# EAGLE design board (EAGLE 8.5.1)
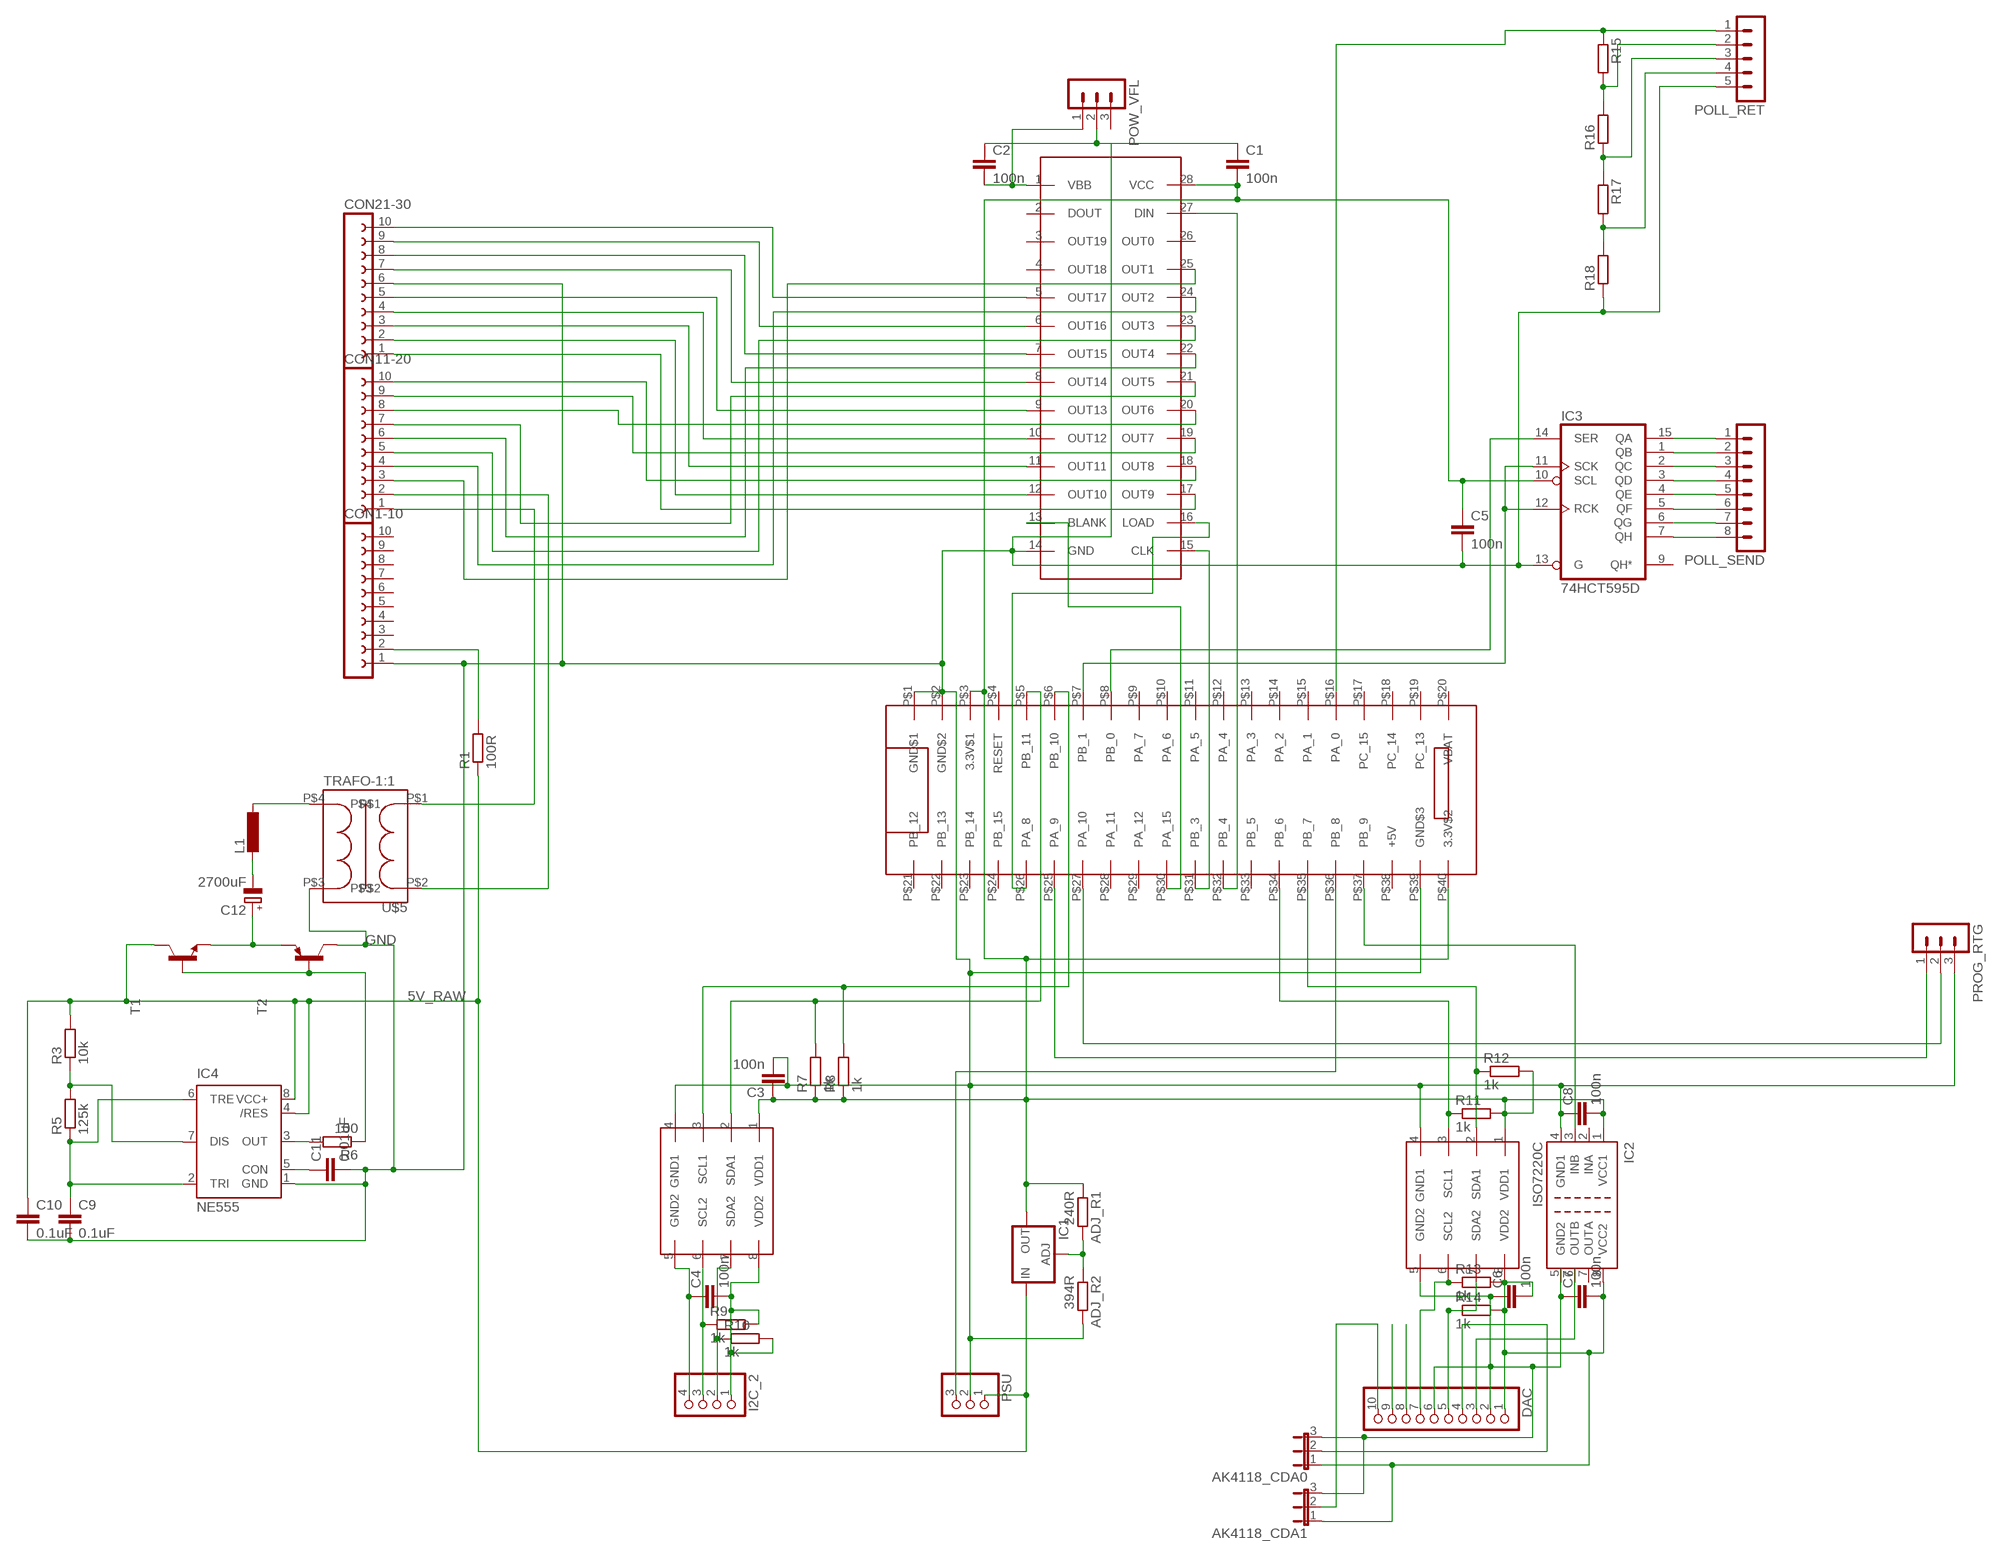
[diagram p0: schematic, sheet 1]

## Parts
ADJ_R1  240R  R-EU_0207/10  [0207/10]
ADJ_R2  394R  R-EU_0207/10  [0207/10]
AK4118_CDA0  JP2E  [JP2]
AK4118_CDA1  JP2E  [JP2]
C1  100n  C-EUC1206  [C1206]
C2  100n  C-EUC1206  [C1206]
C3  100n  C-EUC1206  [C1206]
C4  100n  C-EUC1206  [C1206]
C5  100n  C-EUC1206  [C1206]
C6  100n  C-EUC1206  [C1206]
C7  100n  C-EUC1210  [C1210]
C8  100n  C-EUC1210  [C1210]
C9  0.1uF  C-EUC1206  [C1206]
C10  0.1uF  C-EUC1206  [C1206]
C11  0.01uF  C-EUC1206  [C1206]
C12  2700uF  CPOL-EUE3.5-8  [E3,5-8]
CON1-10  FE10-1  [FE10]
CON11-20  FE10-1  [FE10]
CON21-30  FE10-1  [FE10]
DAC  PINHD-1X10  [1X10]
I2C_2  PINHD-1X4  [1X04]
IC1  LM317TS  [317TS]
IC2  ISO7220C  [SO-08]
IC3  74HCT595D  [SO16]
IC4  NE555  [DIL-08]
L1  L-EU0204/5  [0204/5]
POLL_RET  MA05-1  [MA05-1]
POLL_SEND  MA08-1  [MA08-1]
POW_VFL  MA03-1  [MA03-1]
PROG_RTG  MA03-1  [MA03-1]
PSU  PINHD-1X3  [1X03]
R1  100R  R-EU_0207/10  [0207/10]
R3  10k  R-EU_R1206  [R1206]
R5  125k  R-EU_R1206  [R1206]
R6  100  R-EU_R1206  [R1206]
R7  1k  R-EU_M1206  [M1206]
R8  1k  R-EU_M1206  [M1206]
R9  1k  R-EU_M1206  [M1206]
R10  1k  R-EU_M1206  [M1206]
R11  1k  R-EU_M1206  [M1206]
R12  1k  R-EU_M1206  [M1206]
R13  1k  R-EU_M1206  [M1206]
R14  1k  R-EU_M1206  [M1206]
R15  R-EU_M1206  [M1206]
R16  R-EU_M1206  [M1206]
R17  R-EU_M1206  [M1206]
R18  R-EU_M1206  [M1206]
T1  -NPN-TO92  [TO92]
T2  -PNP-TO92  [TO92]
U$1  ADUM1250  [SO8]
U$2  ADUM1250  [SO8]
U$3  STM32F103C8T6_BOARD  [STM32F103C8T6_BOARD]
U$4  MAX6921AWI  [SO28L]
U$5  TRAFO-1:1  [TRAFO-10-12.5]

## Nets
5V_RAW: C10.1 IC1.3(IN) IC4.4(/RES) IC4.8(VCC+) PSU.1 R1.1 R3.2 T1.3(C)
74HC_SELECT: DAC.3 IC2.6(OUTB)
4118_CAD0: AK4118_CDA1.2 DAC.10
4118_CAD1: AK4118_CDA0.2 DAC.4
4490_CSN: DAC.9
4490_WCK: DAC.8
GND: ADJ_R2.2 C1.1 C2.1 C3.2 C5.2 C8.1 C9.2 C10.2 C11.2 CON1-10.1 CON21-30.6 IC2.4(GND1) IC3.13(G) IC4.1(GND) POLL_RET.5 POW_VFL.2 PROG_RTG.3 PSU.2 R18.1 T2.3(C) U$1.4(GND1) U$2.4(GND1) U$3.P$1(GND$1) U$3.P$2(GND$2) U$3.P$39(GND$3) U$4.14(GND) U$5.P$3
GND_DAC: AK4118_CDA0.3 AK4118_CDA1.3 C6.1 C7.1 DAC.2 DAC.6 IC2.5(GND2) U$1.5(GND2)
GND_I2C2: C4.1 I2C_2.4 U$2.5(GND2)
I2C1_SDA: R12.1 U$1.2(SDA1) U$3.P$35(PB_7)
I2C1_SDL: R11.1 U$1.3(SCL1) U$3.P$34(PB_6)
I2C2_SDA: R7.2 U$2.2(SDA1) U$3.P$5(PB_11)
I2C2_SDL: R8.2 U$2.3(SCL1) U$3.P$6(PB_10)
N$1: ADJ_R1.2 ADJ_R2.1 IC1.1(ADJ)
N$2: U$3.P$31(PB_3) U$4.15(CLK)
N$3: IC3.11(SCK) IC3.12(RCK) U$3.P$7(PB_1)
N$4: I2C_2.3 R9.1 U$2.6(SCL2)
N$5: I2C_2.2 R10.1 U$2.7(SDA2)
N$6: C4.2 I2C_2.1 R9.2 R10.2 U$2.8(VDD2)
N$7: CON1-10.2 R1.2
N$8: CON11-20.1 U$5.P$1
N$9: CON11-20.2 U$5.P$2
N$10: IC2.3(INB) U$3.P$37(PB_9)
N$11: CON11-20.7 U$4.21(OUT5)
N$12: CON21-30.10 U$4.5(OUT17)
N$13: CON21-30.9 U$4.6(OUT16)
N$14: PROG_RTG.1 U$3.P$25(PA_9)
N$15: PROG_RTG.2 U$3.P$27(PA_10)
N$16: U$3.P$32(PB_4) U$4.27(DIN)
N$17: U$3.P$26(PA_8) U$4.16(LOAD)
N$18: U$3.P$30(PA_15) U$4.13(BLANK)
N$19: CON21-30.8 U$4.7(OUT15)
N$20: CON21-30.7 U$4.8(OUT14)
N$21: CON21-30.5 U$4.9(OUT13)
N$22: CON21-30.4 U$4.10(OUT12)
N$23: CON21-30.3 U$4.11(OUT11)
N$24: C2.2 POW_VFL.1 U$4.1(VBB)
N$25: IC3.14(SER) U$3.P$8(PB_0)
N$26: IC3.15(QA) POLL_SEND.1
N$27: IC3.1(QB) POLL_SEND.2
N$28: IC3.2(QC) POLL_SEND.3
N$29: IC3.3(QD) POLL_SEND.4
N$30: IC3.4(QE) POLL_SEND.5
N$31: CON21-30.2 U$4.12(OUT10)
N$32: CON21-30.1 U$4.17(OUT9)
N$33: CON11-20.10 U$4.18(OUT8)
N$34: CON11-20.9 U$4.19(OUT7)
N$35: CON11-20.8 U$4.20(OUT6)
N$36: CON11-20.6 U$4.22(OUT4)
N$37: CON11-20.5 U$4.23(OUT3)
N$38: CON11-20.4 U$4.24(OUT2)
N$39: CON11-20.3 U$4.25(OUT1)
N$40: C11.1 IC4.5(CON)
N$41: IC4.7(DIS) R3.1 R5.2
N$42: C9.1 IC4.2(TRI) IC4.6(TRE) R5.1
N$43: IC4.3(OUT) R6.2
N$44: C12.+ T1.1(E) T2.1(E)
N$45: L1.1 U$5.P$4
N$46: IC3.5(QF) POLL_SEND.6
N$47: IC3.6(QG) POLL_SEND.7
N$48: IC3.7(QH) POLL_SEND.8
N$49: R6.1 T1.2(B) T2.2(B)
N$50: POLL_RET.1 R15.1 U$3.P$16(PA_0)
N$51: POLL_RET.2 R15.2 R16.2
N$52: POLL_RET.3 R16.1 R17.1
N$53: POLL_RET.4 R17.2 R18.2
N$54: C12.- L1.2
RELAY_CTRL: PSU.3 U$3.P$36(PB_8)
SCL: DAC.7 R13.1 U$1.6(SCL2)
SDA: DAC.5 R14.1 U$1.7(SDA2)
VCC: ADJ_R1.1 C1.2 C3.1 C5.1 C8.2 IC1.2(OUT) IC2.1(VCC1) IC3.10(SCL) R7.1 R8.1 R11.2 R12.2 U$1.1(VDD1) U$2.1(VDD1) U$3.P$3(3.3V$1) U$3.P$40(3.3V$2) U$4.28(VCC)
VCC_DAC: AK4118_CDA0.1 AK4118_CDA1.1 C6.2 C7.2 DAC.1 IC2.8(VCC2) R13.2 R14.2 U$1.8(VDD2)
Unconnected: CON1-10.3 CON1-10.4 CON1-10.5 CON1-10.6 CON1-10.7 CON1-10.8 CON1-10.9 CON1-10.10 IC2.2(INA) IC2.7(OUTA) IC3.9(QH*) POW_VFL.3 U$3.P$4(RESET) U$3.P$9(PA_7) U$3.P$10(PA_6) U$3.P$11(PA_5) U$3.P$12(PA_4) U$3.P$13(PA_3) U$3.P$14(PA_2) U$3.P$15(PA_1) U$3.P$17(PC_15) U$3.P$18(PC_14) U$3.P$19(PC_13) U$3.P$20(VBAT) U$3.P$21(PB_12) U$3.P$22(PB_13) U$3.P$23(PB_14) U$3.P$24(PB_15) U$3.P$28(PA_11) U$3.P$29(PA_12) U$3.P$33(PB_5) U$3.P$38(+5V) U$4.2(DOUT) U$4.3(OUT19) U$4.4(OUT18) U$4.26(OUT0)

## Power pins joined to a net without a drawn wire
GND: IC3.8(GND)
VCC: IC3.16(VCC)

## Library data of the parts
ADJ_R1 ADJ_R2 R1 R3 R5-R18 = rcl:R-EU_: RESISTOR, European symbol; SPICEPREFIX: R
AK4118_CDA0 AK4118_CDA1 = jumper:JP2E: JUMPER
C1-C11 = rcl:C-EU: CAPACITOR, European symbol; SPICEPREFIX: C
C12 = rcl:CPOL-EU: POLARIZED CAPACITOR, European symbol; SPICEPREFIX: C
CON1-10 CON11-20 CON21-30 = con-lsta:FE10-1: FEMALE HEADER; OC_FARNELL: unknown; OC_NEWARK: unknown
DAC = pinhead:PINHD-1X10: PIN HEADER
I2C_2 = pinhead:PINHD-1X4: PIN HEADER
IC1 = v-reg:LM317TS: VOLTAGE REGULATOR
IC2 = texas:ISO7220: DUAL DIGITAL ISOLATORS Source: http://focus.ti.com/lit/ds/symlink/iso7221a.pdf; MPN: ISO7220CD; OC_FARNELL: 1390644; OC_NEWARK: 48M0668
IC3 = 74xx-eu:74*595: 8-bit SHIFT REGISTER, output latch
IC4 = st-microelectronics:NE555: General purpose bipolar Timer; MF: Arrow Electronics; MPN: NE555N; OC_FARNELL: 1467742; OC_NEWARK: 89K1486
L1 = rcl:L-EU: INDUCTOR, European symbol; SPICEPREFIX: L
POLL_RET = con-lstb:MA05-1: PIN HEADER; OC_FARNELL: unknown; OC_NEWARK: unknown
POLL_SEND = con-lstb:MA08-1: PIN HEADER; OC_FARNELL: unknown; OC_NEWARK: unknown
POW_VFL PROG_RTG = con-lstb:MA03-1: PIN HEADER; OC_FARNELL: unknown; OC_NEWARK: unknown
PSU = pinhead:PINHD-1X3: PIN HEADER
T1 = transistor:*-NPN-: NPN Transistror BF959 corrected 2008.03.06
T2 = transistor:*-PNP-: PNP Transistror
U$1 U$2 = archi_laptop:ADUM1250
U$3 = archi_laptop:STM32F103C8T6_BOARD
U$4 = archi_laptop:MAX6921AWI
U$5 = archi_laptop:TRAFO-1:1

## Board
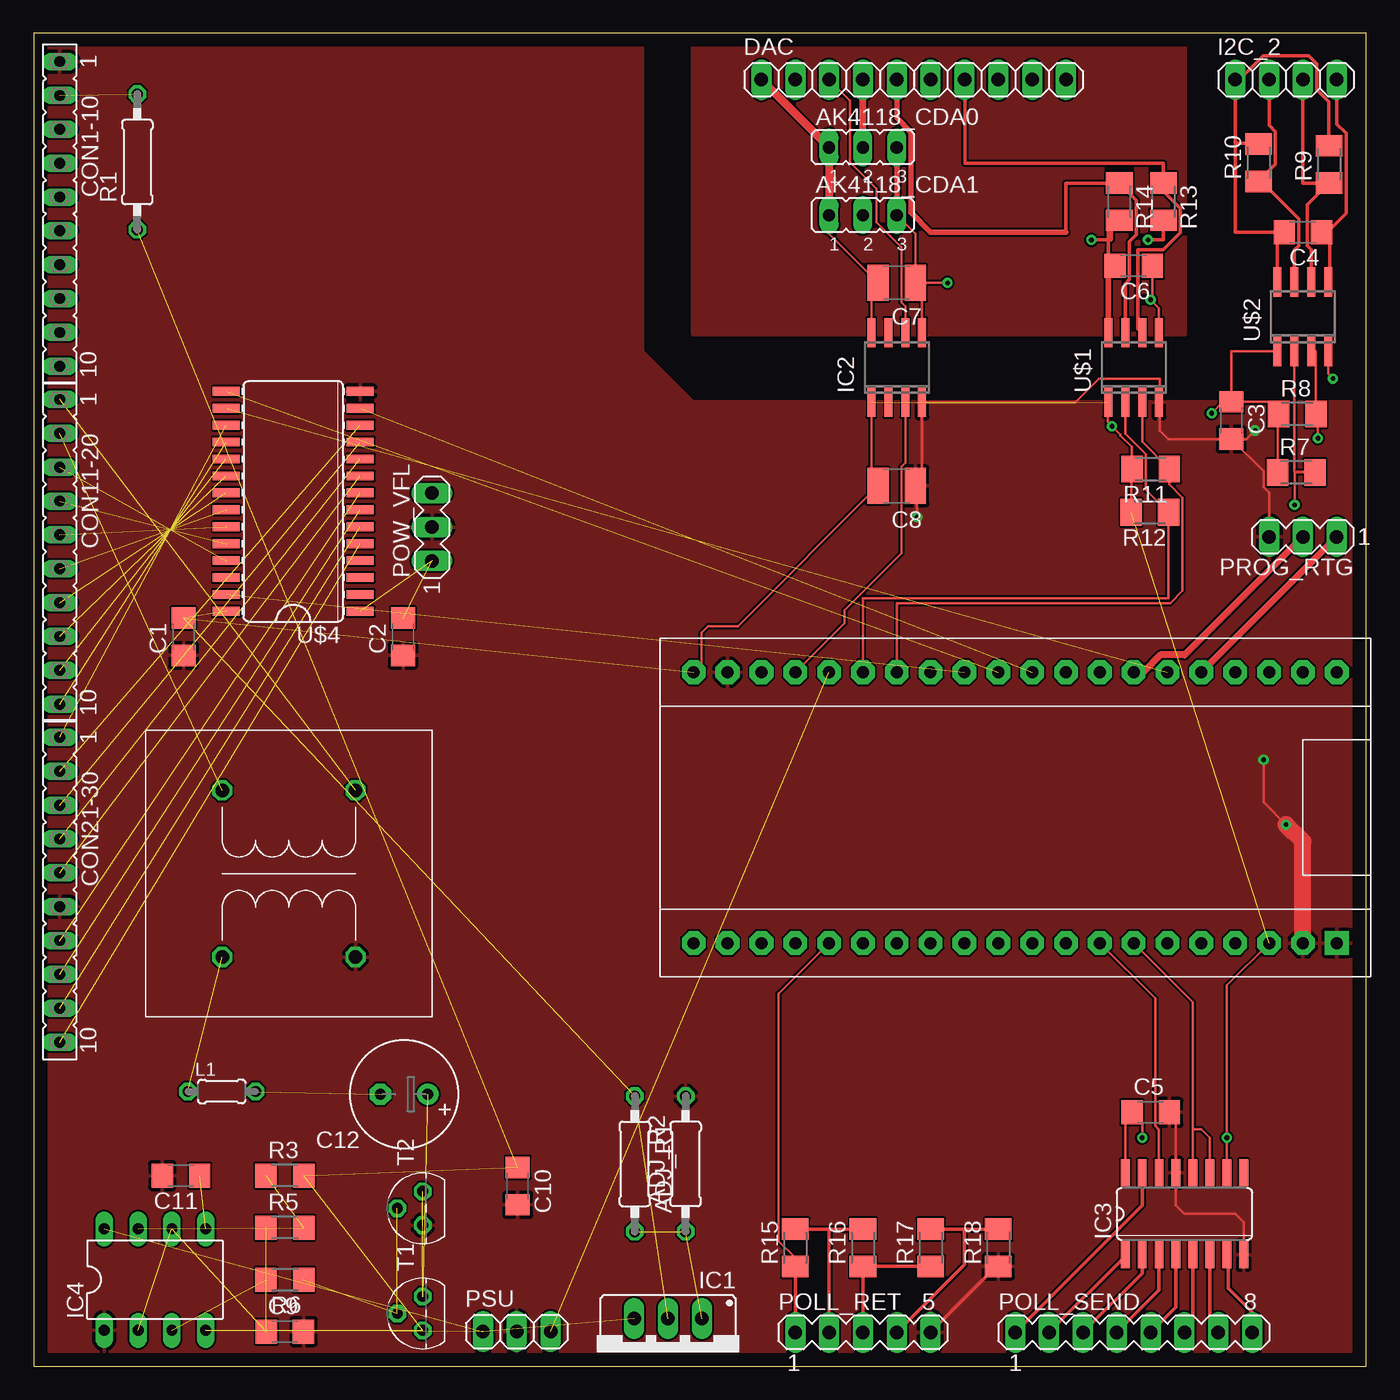
[diagram p1: board, top side]
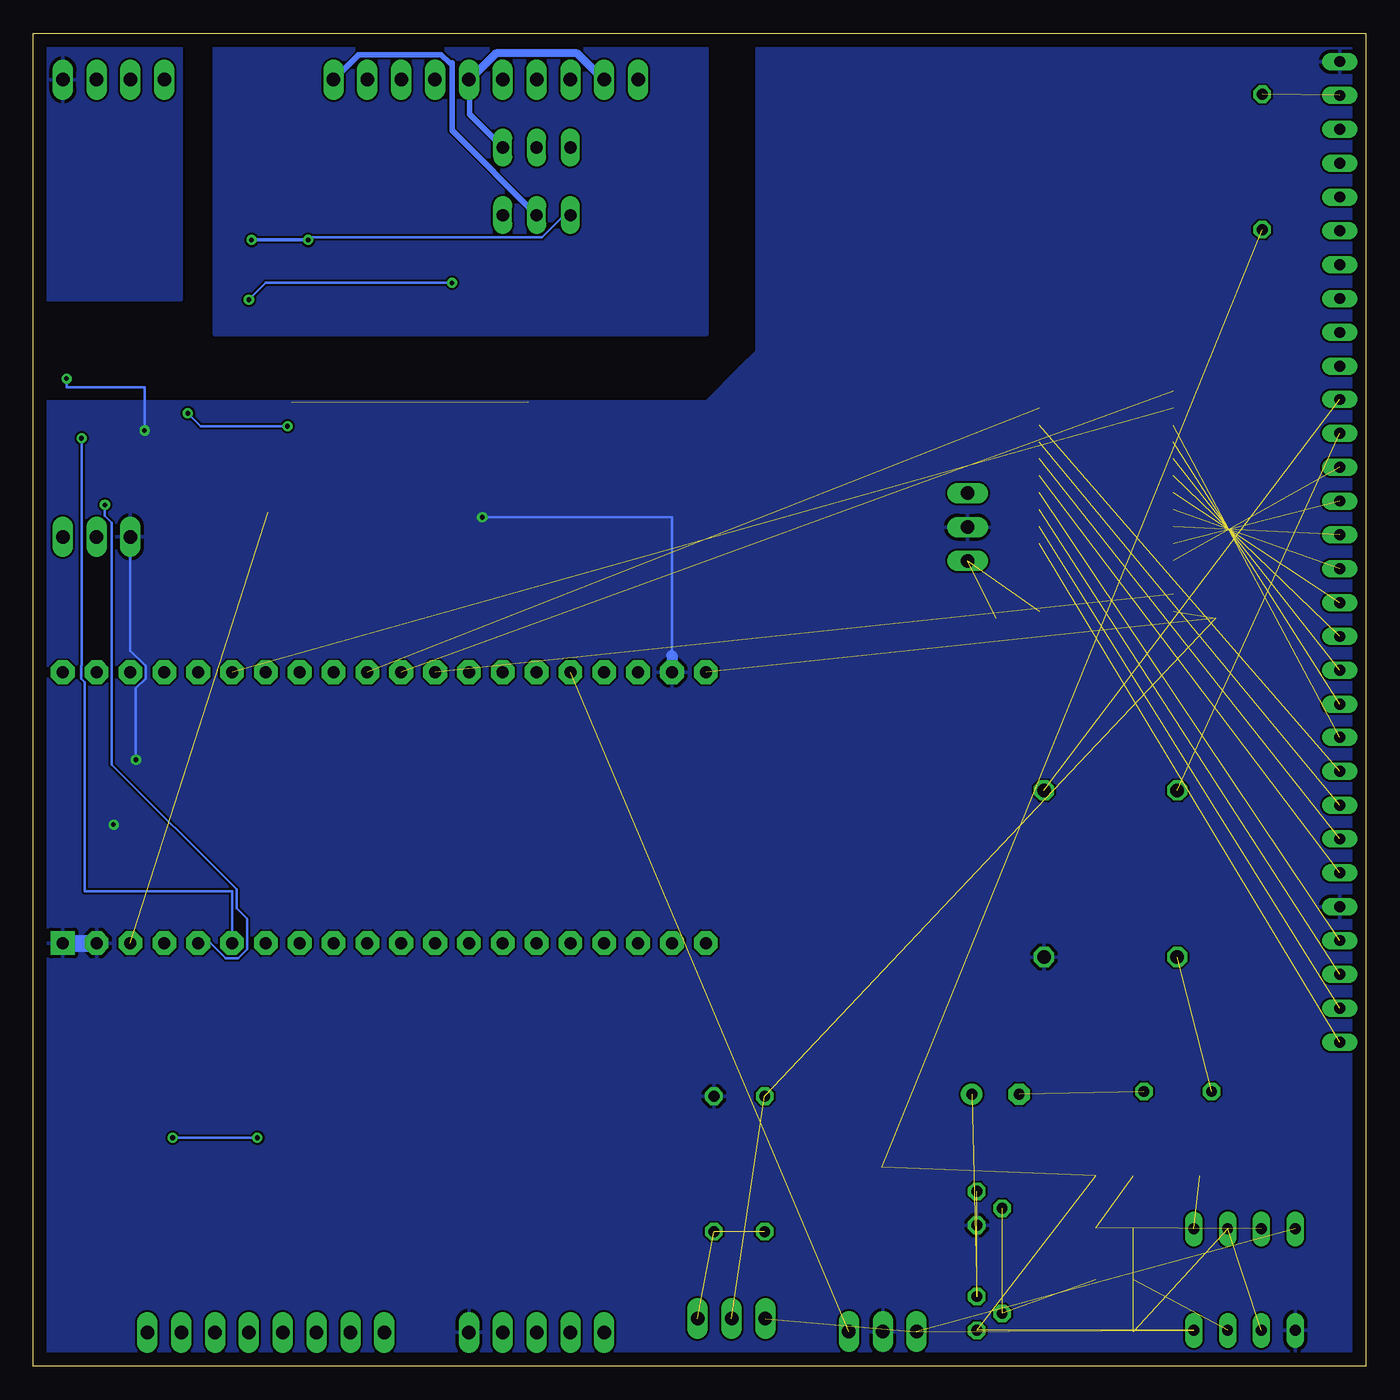
[diagram p2: board, bottom side, seen from below]

Size 100 x 100 mm. Coordinates in mm from the lower left corner, seen from the top.
Outline: 0,0 100,0 100,100 0,100 0,0
Copper layers (1*16): Top 0.035mm / dielectric 1.5mm / Bottom 0.035mm
Design rules "default": minimum track width 6mil, minimum drill 0.35mm, track to track 6mil, track to pad 6mil, pad to pad 6mil, via to via 6mil, smd to smd 6mil, copper to edge 40mil, drill to drill 6mil, minimum pad ring 10mil, minimum via ring 8mil, stop-mask expansion 4mil, vias tented up to drill 0mil, thermal gap 10mil

### Footprints (pad centres in the part's own frame; a part is rotated, then mirrored left to right if it is on the bottom)
0207/10 = drill 0.813 octagon: 1 -5.08,0; 2 5.08,0
JP2 = drill 0.914 long: 1 -2.54,0; 2 0,0; 3 2.54,0
C1206 = smd 1.6 x 1.8: 1 -1.4,0; 2 1.4,0
C1210 = smd 1.6 x 2.7: 1 -1.4,0; 2 1.4,0
E3,5-8 = drill 0.813 pad 1.6: + -1.778,0 | drill 0.813 pad 1.6 octagon: - 1.778,0
FE10 = drill 0.813 long: 1 -11.43,0; 2 -8.89,0; 3 -6.35,0; 4 -3.81,0; 5 -1.27,0; 6 1.27,0; 7 3.81,0; 8 6.35,0; 9 8.89,0; 10 11.43,0
1X10 = drill 1.016 long: 1 -11.43,0; 2 -8.89,0; 3 -6.35,0; 4 -3.81,0; 5 -1.27,0; 6 1.27,0; 7 3.81,0; 8 6.35,0; 9 8.89,0; 10 11.43,0
1X04 = drill 1.016 long: 1 -3.81,0; 2 -1.27,0; 3 1.27,0; 4 3.81,0
317TS = drill 1.016 long: 1 -2.54,-2.54; 2 0,-2.54; 3 2.54,-2.54
SO-08 = smd 0.6 x 2.2: 1 -1.905,-2.6; 2 -0.635,-2.6; 3 0.635,-2.6; 4 1.905,-2.6; 5 1.905,2.6; 6 0.635,2.6; 7 -0.635,2.6; 8 -1.905,2.6
SO16 = smd 0.66 x 2.032: 1 -4.445,-3.073; 2 -3.175,-3.073; 3 -1.905,-3.073; 4 -0.635,-3.073; 5 0.635,-3.073; 6 1.905,-3.073; 7 3.175,-3.073; 8 4.445,-3.073; 9 4.445,3.073; 10 3.175,3.073; 11 1.905,3.073; 12 0.635,3.073; 13 -0.635,3.073; 14 -1.905,3.073; 15 -3.175,3.073; 16 -4.445,3.073
DIL-08 = drill 0.813 long: 1 -3.81,-3.81; 2 -1.27,-3.81; 3 1.27,-3.81; 4 3.81,-3.81; 5 3.81,3.81; 6 1.27,3.81; 7 -1.27,3.81; 8 -3.81,3.81
0204/5 = drill 0.813 octagon: 1 -2.54,0; 2 2.54,0
MA05-1 = drill 1.016 long: 1 -5.08,0; 2 -2.54,0; 3 0,0; 4 2.54,0; 5 5.08,0
MA08-1 = drill 1.016 long: 1 -8.89,0; 2 -6.35,0; 3 -3.81,0; 4 -1.27,0; 5 1.27,0; 6 3.81,0; 7 6.35,0; 8 8.89,0
MA03-1 = drill 1.016 long: 1 -2.54,0; 2 0,0; 3 2.54,0
1X03 = drill 1.016 long: 1 -2.54,0; 2 0,0; 3 2.54,0
R1206 = smd 1.6 x 1.803: 1 -1.422,0; 2 1.422,0
M1206 = smd 1.6 x 2: 1 -1.4,0; 2 1.4,0
TO92 = drill 0.813 octagon: 1 1.27,0; 2 0,1.905; 3 -1.27,0
SO8 = smd 0.6 x 2.2: 1 -1.905,-2.6; 2 -0.635,-2.6; 3 0.635,-2.6; 4 1.905,-2.6; 5 1.905,2.6; 6 0.635,2.6; 7 -0.635,2.6; 8 -1.905,2.6
STM32F103C8T6_BOARD = drill 0.9 pad 1.778 square: P$1 -10.16,-25.4 | drill 0.9 pad 1.778 octagon: P$2 -10.16,-22.86; P$3 -10.16,-20.32; P$4 -10.16,-17.78; P$5 -10.16,-15.24; P$6 -10.16,-12.7; P$7 -10.16,-10.16; P$8 -10.16,-7.62; P$9 -10.16,-5.08; P$10 -10.16,-2.54; P$11 -10.16,0; P$12 -10.16,2.54; P$13 -10.16,5.08; P$14 -10.16,7.62; P$15 -10.16,10.16; P$16 -10.16,12.7; P$17 -10.16,15.24; P$18 -10.16,17.78; P$19 -10.16,20.32; P$20 -10.16,22.86; P$21 10.16,-25.4; P$22 10.16,-22.86; P$23 10.16,-20.32; P$24 10.16,-17.78; P$25 10.16,-15.24; P$26 10.16,-12.7; P$27 10.16,-10.16; P$28 10.16,-7.62; P$29 10.16,-5.08; P$30 10.16,-2.54; P$31 10.16,0; P$32 10.16,2.54; P$33 10.16,5.08; P$34 10.16,7.62; P$35 10.16,10.16; P$36 10.16,12.7; P$37 10.16,15.24; P$38 10.16,17.78; P$39 10.16,20.32; P$40 10.16,22.86
SO28L = smd 0.66 x 2.032: 1 -8.255,-5.029; 2 -6.985,-5.029; 3 -5.715,-5.029; 4 -4.445,-5.029; 5 -3.175,-5.029; 6 -1.905,-5.029; 7 -0.635,-5.029; 8 0.635,-5.029; 9 1.905,-5.029; 10 3.175,-5.029; 11 4.445,-5.029; 12 5.715,-5.029; 13 6.985,-5.029; 14 8.255,-5.029; 15 8.255,5.029; 16 6.985,5.029; 17 5.715,5.029; 18 4.445,5.029; 19 3.175,5.029; 20 1.905,5.029; 21 0.635,5.029; 22 -0.635,5.029; 23 -1.905,5.029; 24 -3.175,5.029; 25 -4.445,5.029; 26 -5.715,5.029; 27 -6.985,5.029; 28 -8.255,5.029
TRAFO-10-12.5 = drill 1 octagon: P$1 -5,-6.25; P$2 5,-6.25; P$3 -5,6.25; P$4 5,6.25

### Placement (x,y rotation side)
ADJ_R1  45.11,15.18 270 top
ADJ_R2  48.92,15.18 90 top
AK4118_CDA0  62.23,91.44 0 top
AK4118_CDA1  62.23,86.36 0 top
C1  11.24,54.73 90 top
C2  27.72,54.73 90 top
C3  89.87,70.95 270 top
C4  95.25,85.09 180 top
C5  83.82,19.05 0 top
C6  82.55,82.55 180 top
C7  64.77,81.28 180 top
C8  64.77,66.04 180 top
C9  18.85,2.6 0 top
C10  36.32,13.52 270 top
C11  11.05,14.3 180 top
C12  27.79,20.4 180 top
CON1-10  1.95,86.45 270 top
CON11-20  1.95,61.1 270 top
CON21-30  1.95,35.75 270 top
DAC  66.04,96.52 0 top
I2C_2  93.98,96.52 0 top
IC1  47.6,1.04 180 top
IC2  64.77,74.93 0 top
IC3  86.36,11.43 0 top
IC4  9.1,6.5 0 top
L1  14.11,20.61 0 top
POLL_RET  62.23,2.54 0 top
POLL_SEND  82.55,2.54 0 top
POW_VFL  29.89,62.96 90 top
PROG_RTG  95.25,62.23 180 top
PSU  36.25,2.6 0 top
R1  7.77,90.35 90 top
R3  18.85,14.3 0 top
R5  18.85,10.4 0 top
R6  18.85,6.5 180 top
R7  94.75,67.06 0 top
R8  94.83,71.44 0 top
R9  97.21,90.17 90 top
R10  91.92,90.3 90 top
R11  83.82,67.31 180 top
R12  83.76,64.06 180 top
R13  84.78,87.37 270 top
R14  81.47,87.37 270 top
R15  57.15,8.89 90 top
R16  62.23,8.89 90 top
R17  67.31,8.89 90 top
R18  72.39,8.89 90 top
T1  29.19,3.96 90 top
T2  29.19,11.85 90 top
U$1  82.55,74.93 0 top
U$2  95.25,78.74 0 top
U$3  72.39,41.91 90 top
U$4  19.48,64.89 90 top
U$5  19.15,36.95 180 top

### Tracks (layer width: path | path; a pad name or v marks a point on that pad's centre or on a via)
5V_RAW  (7 unrouted)
74HC_SELECT
  Top 0.2: IC2.6 65.41,79.54 65.12,79.83 65.12,83.94 63.24,85.81 63.24,88.35 61.27,90.33 61.27,94.94 DAC.3
4118_CAD0
  Bottom 0.406: DAC.10 75.59,98.4 69.39,98.4 68.78,97.79 68.58,97.79 68.58,92.71 AK4118_CDA1.2
4118_CAD1
  Top 0.508: AK4118_CDA0.2 DAC.4
DAC_GND
  pour Top: 86.36,100.33 86.36,77.47 49.53,77.47 49.53,100.33
  pour Bottom: 49.53,100.33 49.53,77.47 50.8,77.47 86.36,77.47 86.36,100.33
GND  (via drill 0.35)
  Top 0.2: PROG_RTG.3 92.71,65.54 92.3,65.95 92.3,67.13 C3.2 | IC3.8 90.81,10.79 90.17,11.43 86.36,11.43 85.72,12.06 IC3.13 85.72,18.55 C5.2 | v66.3,63.7 66.3,66.04 C8.1 66.67,66.04 IC2.4 78.18,72.33 79.95,74.1 84.5,74.1 84.5,72.38 U$1.4 84.5,72.28 84.5,70.2 85.14,69.56 C3.2 | C3.2 91,69.56 v91.65,70.2 | v97.5,74.1 97.16,74.44 U$2.4 | v92.3,45.5 92.3,42.32 v93.98,40.64
  Top 0.254: POLL_RET.5 72.26,7.49 R18.1
  Top 1.27: U$3.P$2 95.25,39.37 v93.98,40.64
  Bottom 0.2: 52.07,53.34 52.07,63.7 v66.3,63.7 | v91.65,70.2 91.65,73.45 97.5,73.45 v97.5,74.1 | PROG_RTG.3 92.71,53.68 91.57,52.54 91.57,51.6 92.3,50.87 v92.3,45.5
  Bottom 0.406: 52.05,53.31 52.07,53.34
  Bottom 0.813: 52.07,53.34 U$3.P$39
  Bottom 1.27: U$3.P$1 U$3.P$2
  pour Bottom: 45.72,100.33 45.72,76.2 46.99,74.93 49.53,72.39 101.6,72.39 101.6,-1.27 102.87,-2.54 -5.08,-2.54 -5.08,7.62 -5.08,104.14 -2.54,104.14 45.72,104.14
  pour Top: -19.05,104.14 45.72,104.14 45.72,76.2 49.53,72.39 107.95,72.39 115.57,64.77 115.57,-6.35 -3.81,-6.35 -20.32,10.16 -20.32,102.87
GND_DAC  (via drill 0.35)
  Top 0.2: IC2.5 66.67,80.78 C7.1 | C7.1 v68.58,81.28 | U$1.5 84.45,79.38 v83.82,80.01 83.95,80.14 C6.1 | AK4118_CDA1.3 66.17,84.96 C7.1
  Top 0.406: AK4118_CDA1.3 AK4118_CDA0.3
  Bottom 0.2: v68.58,81.28 82.55,81.28 v83.82,80.01
  Bottom 0.406: AK4118_CDA0.3 67.26,93.93 67.26,96.52
  Bottom 0.61: DAC.2 57.2,96.52 59.19,98.5 65.28,98.5 67.26,96.52 DAC.6
GND_I2C2
  Top 0.254: C4.1 96.65,84.88 96.88,84.88 | 96.88,84.88 97.25,84.88 97.25,81.34 U$2.5 | I2C_2.4 97.79,93.19 98.49,92.49 98.49,86.49 96.88,84.88
  pour Bottom: 102.87,101.6 88.9,101.6 88.9,80.01 102.87,80.01
I2C1_SDA
  Top 0.2: U$1.2 81.92,69.97 83.47,68.42 83.47,65.75 R12.1 85.16,57.62 62.23,57.62 U$3.P$35
I2C1_SDL
  Top 0.2: U$1.3 83.19,69.34 R11.1 85.22,66.16 86.21,65.17 86.21,58.18 85.28,57.25 64.77,57.25 U$3.P$34
I2C2_SDA  (via drill 0.35)
  Top 0.2: U$2.2 94.61,67.12 96.15,67.12 R7.2 94.62,67.06 v94.62,64.62
  Bottom 0.2: v94.62,64.62 94.62,63.8 94.11,63.28 94.11,45.14 84.74,35.77 84.74,34.36 83.95,33.57 83.95,31.28 84.62,30.61 85.56,30.61 86.7,31.75 U$3.P$5
I2C2_SDL  (via drill 0.35)
  Top 0.2: v96.38,69.62 96.38,71.44 R8.2 96.23,76.14 U$2.3
  Bottom 0.2: U$3.P$6 85.09,35.62 96.12,35.62 96.12,51.33 96.39,51.6 96.39,52.54 96.38,52.56 v96.38,69.62
N$1  (2 unrouted)
N$2  (1 unrouted)
N$3
  Top 0.2: IC3.11 88.27,17.14 87.63,17.78 87,17.78 | IC3.12 87,17.78 | 87,17.78 87,27.3 U$3.P$7
N$4
  Top 0.254: U$2.6 95.89,83.76 95.57,84.07 95.57,87.13 R9.1 95.25,88.77 I2C_2.3
N$5
  Top 0.254: U$2.7 94.61,83.76 94.93,84.07 94.93,86.11 92.14,88.89 R10.1 93.19,90.17 93.19,92.61 92.71,93.09 I2C_2.2
N$6
  Top 0.254: U$2.8 93.34,85.09 | 93.34,85.09 C4.2 | 93.34,85.09 90.17,85.09 90.17,91.75 | 90.17,91.75 I2C_2.1 90.47,96.52 92.28,98.32 95.68,98.32 96.29,97.71 96.29,95.78 97.21,94.86 R9.2 | R10.2 91.92,91.75 90.17,91.75
N$7  (1 unrouted)
N$8  (1 unrouted)
N$9  (1 unrouted)
N$10
  Top 0.2: IC2.3 65.41,67.78 65.12,67.5 65.12,61.01 60.83,56.73 60.83,55.75 U$3.P$37
N$11  (1 unrouted)
N$12  (1 unrouted)
N$13  (1 unrouted)
N$14
  Top 0.508: PROG_RTG.1 U$3.P$25
N$15
  Top 0.508: PROG_RTG.2 86.39,53.37 84.55,53.37 83.26,52.07 U$3.P$27
N$16  (1 unrouted)
N$17  (1 unrouted)
N$18  (1 unrouted)
N$19  (1 unrouted)
N$20  (1 unrouted)
N$21  (1 unrouted)
N$22  (1 unrouted)
N$23  (1 unrouted)
N$24  (2 unrouted)
N$25
  Top 0.2: IC3.14 84.45,17.76 84.17,18.05 84.17,27.59 U$3.P$8
N$26
  Top 0.254: POLL_SEND.1 83.19,12.06 IC3.15
N$27
  Top 0.254: POLL_SEND.2 81.92,8.26 IC3.1
N$28
  Top 0.254: POLL_SEND.3 83.19,6.99 IC3.2
N$29
  Top 0.254: POLL_SEND.4 84.45,5.71 IC3.3
N$30
  Top 0.254: POLL_SEND.5 85.72,4.45 IC3.4
N$31  (1 unrouted)
N$32  (1 unrouted)
N$33  (1 unrouted)
N$34  (1 unrouted)
N$35  (1 unrouted)
N$36  (1 unrouted)
N$37  (1 unrouted)
N$38  (1 unrouted)
N$39  (1 unrouted)
N$40  (1 unrouted)
N$41  (2 unrouted)
N$42  (3 unrouted)
N$43  (1 unrouted)
N$44  (2 unrouted)
N$45  (1 unrouted)
N$46
  Top 0.254: POLL_SEND.6 87,3.17 IC3.5
N$47
  Top 0.254: IC3.6 88.27,3.17 POLL_SEND.7
N$48
  Top 0.254: POLL_SEND.8 91.44,4.06 89.66,5.84 89.66,8.23 IC3.7
N$49  (2 unrouted)
N$50
  Top 0.2: R15.1 57.15,8.13 55.9,9.38 55.9,27.96 U$3.P$16
  Top 0.254: R15.1 POLL_RET.1
N$51
  Top 0.254: R16.2 59.69,10.29 | 59.69,10.29 R15.2 | POLL_RET.2 59.69,10.29
N$52
  Top 0.254: R17.1 R16.1 POLL_RET.3
N$53
  Top 0.254: R18.2 69.85,10.29 | 69.85,10.29 R17.2 | POLL_RET.4 69.85,7.62 69.85,10.29
N$54  (1 unrouted)
RELAY_CTRL  (1 unrouted)
SCL
  Top 0.254: U$1.6 82.87,77.84 82.87,83.57 82.88,83.57 82.88,83.75 84.76,83.75 86.06,85.05 86.06,86.89 84.78,88.17 R13.1 84.78,90.25 69.88,90.25 69.88,96.52 DAC.7
SDA
  Top 0.254: U$1.7 81.92,81.22 82.23,81.53 82.23,84.35 82.75,84.87 82.75,87.49 R14.1 77.47,88.77 77.47,85.09
  Top 0.406: 77.47,85.09 76.88,85.09 67.31,85.09 65.84,86.56 65.84,92.59 64.77,93.66 DAC.5
VCC  (via drill 0.35)  (6 unrouted)
  Top 0.2: R12.2 82.36,67.31 R11.2 82.42,68.97 81.56,69.83 81.56,69.89 v80.92,70.53 80.6,70.85 80.6,72.28 U$1.1 | C3.1 89.87,76.14 U$2.1 | C3.1 93.35,72.36 | R8.1 93.43,72.36 93.35,72.36 | R7.1 93.35,72.36 | IC3.10 v89.53,17.14 89.53,28.57 U$3.P$3 | IC3.16 81.92,18.55 C5.1 83.19,18.29 v83.19,17.14 | IC2.1 62.87,66.55 arc90 C8.2 52.84,55.51 50.61,55.51 50.12,55.01 50.12,52.66 U$3.P$40 | C3.1 89.25,72.36 v88.4,71.5
  Bottom 0.2: v83.19,17.14 v89.53,17.14 | v80.92,70.53 87.42,70.53 v88.4,71.5
VCC_DAC  (via drill 0.35)
  Top 0.2: IC2.8 62.87,80.78 C7.2 59.69,84.96 AK4118_CDA1.1
  Top 0.254: R14.2 80.88,85.97 | 80.88,85.97 80.64,85.97 80.64,82.12 | R13.2 84.78,84.5 v83.62,84.5 | v79.38,84.5 80.88,84.5 80.88,85.97
  Top 0.406: U$1.8 80.64,82.12 80.64,82.55 C6.2
  Top 0.61: AK4118_CDA1.1 AK4118_CDA0.1 DAC.1 54.61,95.25
  Bottom 0.2: AK4118_CDA1.1 60.16,86.36 61.83,84.69 79.19,84.69 v79.38,84.5
  Bottom 0.254: v83.62,84.5 v79.38,84.5